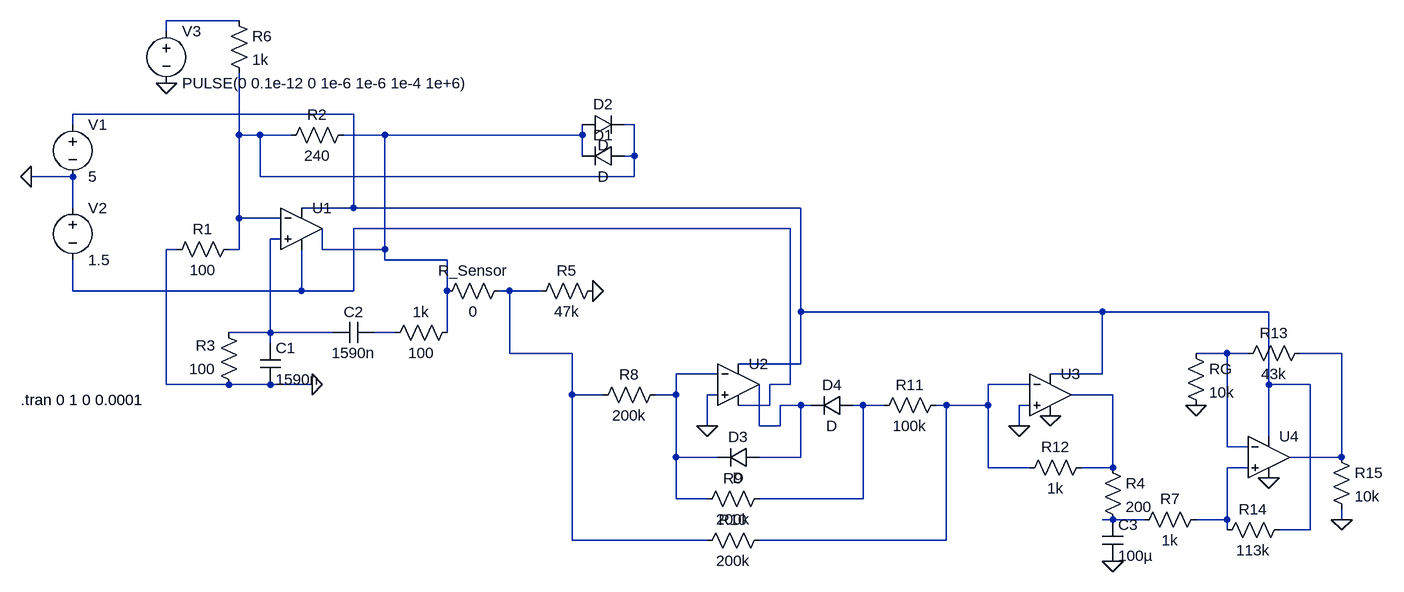
[diagram p0: schematic humidity.asc]
humidity.asc, the LTspice schematic file:
Version 4.1
SHEET 1 2160 724
WIRE 96 -176 -16 -176
WIRE -16 -160 -16 -176
WIRE 272 -32 -160 -32
WIRE -160 -16 -160 -32
WIRE 704 -16 688 -16
WIRE 96 0 96 -96
WIRE 128 0 96 0
WIRE 176 0 128 0
WIRE 320 0 256 0
WIRE 624 0 624 -16
WIRE 624 0 320 0
WIRE 624 32 624 0
WIRE 704 32 704 -16
WIRE 704 32 688 32
WIRE -160 64 -224 64
WIRE 128 64 128 0
WIRE 704 64 704 32
WIRE 704 64 128 64
WIRE -160 112 -160 64
WIRE 272 112 272 -32
WIRE 272 112 192 112
WIRE 960 112 272 112
WIRE 96 128 96 0
WIRE 160 128 96 128
WIRE 944 144 272 144
WIRE 160 160 144 160
WIRE 0 176 -16 176
WIRE 96 176 96 128
WIRE 96 176 80 176
WIRE 224 176 224 144
WIRE 320 176 320 0
WIRE 320 176 224 176
WIRE 320 192 320 176
WIRE 416 192 320 192
WIRE -160 240 -160 192
WIRE 192 240 192 176
WIRE 192 240 -160 240
WIRE 272 240 272 144
WIRE 272 240 192 240
WIRE 416 240 416 192
WIRE 512 240 496 240
WIRE 560 240 512 240
WIRE 960 272 960 112
WIRE 1424 272 960 272
WIRE 1680 272 1424 272
WIRE 144 304 144 160
WIRE 144 304 80 304
WIRE 240 304 144 304
WIRE 336 304 304 304
WIRE 416 304 416 240
WIRE 144 320 144 304
WIRE 512 336 512 240
WIRE 608 336 512 336
WIRE 1616 336 1568 336
WIRE 1648 336 1616 336
WIRE 1792 336 1728 336
WIRE 960 352 960 272
WIRE 960 352 864 352
WIRE 832 368 768 368
WIRE 1424 368 1424 272
WIRE 1424 368 1344 368
WIRE -16 384 -16 176
WIRE 80 384 -16 384
WIRE 144 384 80 384
WIRE 208 384 144 384
WIRE 944 384 944 144
WIRE 944 384 912 384
WIRE 1312 384 1248 384
WIRE 1680 384 1680 272
WIRE 1744 384 1680 384
WIRE 608 400 608 336
WIRE 656 400 608 400
WIRE 768 400 768 368
WIRE 768 400 736 400
WIRE 832 400 816 400
WIRE 1440 400 1376 400
WIRE 912 416 912 384
WIRE 912 416 864 416
WIRE 960 416 928 416
WIRE 976 416 960 416
WIRE 1056 416 1040 416
WIRE 1088 416 1056 416
WIRE 1184 416 1168 416
WIRE 1248 416 1248 384
WIRE 1248 416 1184 416
WIRE 1312 416 1296 416
WIRE 816 448 816 400
WIRE 896 448 896 384
WIRE 928 448 928 416
WIRE 928 448 896 448
WIRE 1296 448 1296 416
WIRE 1680 464 1680 384
WIRE 1616 480 1616 336
WIRE 1648 480 1616 480
WIRE 768 496 768 400
WIRE 832 496 768 496
WIRE 960 496 960 416
WIRE 960 496 896 496
WIRE 1792 496 1792 336
WIRE 1792 496 1712 496
WIRE 1248 512 1248 416
WIRE 1312 512 1248 512
WIRE 1440 512 1440 400
WIRE 1440 512 1392 512
WIRE 1648 512 1616 512
WIRE 768 560 768 496
WIRE 816 560 768 560
WIRE 1056 560 1056 416
WIRE 1056 560 896 560
WIRE 1440 592 1424 592
WIRE 1488 592 1440 592
WIRE 1616 592 1616 512
WIRE 1616 592 1568 592
WIRE 1792 592 1792 576
WIRE 1616 608 1616 592
WIRE 1744 608 1744 384
WIRE 1744 608 1696 608
WIRE 608 624 608 400
WIRE 816 624 608 624
WIRE 1184 624 1184 416
WIRE 1184 624 896 624
FLAG 208 384 0
FLAG -224 64 0
FLAG -16 -80 0
FLAG 1344 432 0
FLAG 640 240 0
FLAG 816 448 0
FLAG 1296 448 0
FLAG 1568 416 0
FLAG 1680 528 0
FLAG 1792 592 0
FLAG 1440 656 0
SYMBOL res 96 160 R90
WINDOW 0 0 56 VBottom 2
WINDOW 3 32 56 VTop 2
SYMATTR InstName R1
SYMATTR Value 100
SYMBOL res 272 -16 R90
WINDOW 0 0 56 VBottom 2
WINDOW 3 32 56 VTop 2
SYMATTR InstName R2
SYMATTR Value 240
SYMBOL res 96 400 R180
WINDOW 0 36 76 Left 2
WINDOW 3 36 40 Left 2
SYMATTR InstName R3
SYMATTR Value 100
SYMBOL cap 128 320 R0
SYMATTR InstName C1
SYMATTR Value 1590n
SYMBOL cap 304 288 R90
WINDOW 0 0 32 VBottom 2
WINDOW 3 32 32 VTop 2
SYMATTR InstName C2
SYMATTR Value 1590n
SYMBOL res 432 288 R90
WINDOW 0 0 56 VBottom 2
WINDOW 3 32 56 VTop 2
SYMATTR InstName 1k
SYMATTR Value 100
SYMBOL voltage -160 -32 R0
WINDOW 123 0 0 Left 0
WINDOW 39 0 0 Left 0
SYMATTR InstName V1
SYMATTR Value 5
SYMBOL voltage -160 96 R0
WINDOW 123 0 0 Left 0
WINDOW 39 0 0 Left 0
SYMATTR InstName V2
SYMATTR Value 1.5
SYMBOL res 80 -192 R0
SYMATTR InstName R6
SYMATTR Value 1k
SYMBOL voltage -16 -176 R0
WINDOW 123 0 0 Left 0
WINDOW 39 0 0 Left 0
SYMATTR InstName V3
SYMATTR Value PULSE(0 0.1e-12 0 1e-6 1e-6 1e-4 1e+6)
SYMBOL diode 688 16 R90
WINDOW 0 0 32 VBottom 2
WINDOW 3 32 32 VTop 2
SYMATTR InstName D1
SYMBOL diode 624 0 R270
WINDOW 0 32 32 VTop 2
WINDOW 3 0 32 VBottom 2
SYMATTR InstName D2
SYMBOL diode 896 480 R90
WINDOW 0 0 32 VBottom 2
WINDOW 3 32 32 VTop 2
SYMATTR InstName D3
SYMBOL res 752 384 R90
WINDOW 0 0 56 VBottom 2
WINDOW 3 32 56 VTop 2
SYMATTR InstName R8
SYMATTR Value 200k
SYMBOL res 912 544 R90
WINDOW 0 0 56 VBottom 2
WINDOW 3 32 56 VTop 2
SYMATTR InstName R9
SYMATTR Value 200k
SYMBOL diode 1040 400 R90
WINDOW 0 0 32 VBottom 2
WINDOW 3 32 32 VTop 2
SYMATTR InstName D4
SYMBOL res 912 608 R90
WINDOW 0 0 56 VBottom 2
WINDOW 3 32 56 VTop 2
SYMATTR InstName R10
SYMATTR Value 200k
SYMBOL res 1184 400 R90
WINDOW 0 0 56 VBottom 2
WINDOW 3 32 56 VTop 2
SYMATTR InstName R11
SYMATTR Value 100k
SYMBOL res 1408 496 R90
WINDOW 0 0 56 VBottom 2
WINDOW 3 32 56 VTop 2
SYMATTR InstName R12
SYMATTR Value 1k
SYMBOL OpAmps\\UniversalOpAmp 864 384 R0
SYMATTR InstName U2
SYMBOL OpAmps\\UniversalOpAmp 1344 400 R0
SYMATTR InstName U3
SYMBOL res 512 224 R90
WINDOW 0 0 56 VBottom 2
WINDOW 3 32 56 VTop 2
SYMATTR InstName R_Sensor
SYMATTR Value 0
SYMBOL OpAmps\\UniversalOpAmp 192 144 R0
SYMATTR InstName U1
SYMBOL res 656 224 R90
WINDOW 0 0 56 VBottom 2
WINDOW 3 32 56 VTop 2
SYMATTR InstName R5
SYMATTR Value 47k
SYMBOL OpAmps\\UniversalOpAmp 1680 496 R0
SYMATTR InstName U4
SYMBOL res 1744 320 R90
WINDOW 0 0 56 VBottom 2
WINDOW 3 32 56 VTop 2
SYMATTR InstName R13
SYMATTR Value 43k
SYMBOL res 1552 320 R0
SYMATTR InstName RG
SYMATTR Value 10k
SYMBOL res 1584 576 R90
WINDOW 0 0 56 VBottom 2
WINDOW 3 32 56 VTop 2
SYMATTR InstName R7
SYMATTR Value 1k
SYMBOL res 1712 592 R90
WINDOW 0 0 56 VBottom 2
WINDOW 3 32 56 VTop 2
SYMATTR InstName R14
SYMATTR Value 113k
SYMBOL res 1776 480 R0
SYMATTR InstName R15
SYMATTR Value 10k
SYMBOL res 1424 496 R0
SYMATTR InstName R4
SYMATTR Value 200
SYMBOL cap 1424 592 R0
SYMATTR InstName C3
SYMATTR Value 100µ
TEXT -240 408 Left 2 !.tran 0 1 0 0.0001

The netlist it stands for:
* humidity.asc
R1 N003 0 100
R2 N004 N003 240
R3 0 N006 100
C1 N006 0 1590n
C2 N008 N006 1590n
R§1k N004 N008 100
V1 N002 0 5
V2 0 N005 1.5
R6 N001 N003 1k
V3 N001 0 PULSE(0 0.1e-12 0 1e-6 1e-6 1e-4 1e+6)
D1 N003 N004 D
D2 N004 N003 D
D3 N014 N011 D
R8 N011 N007 200k
R9 N015 N011 200k
D4 N015 N014 D
R10 N012 N007 200k
R11 N012 N015 100k
R12 N013 N012 1k
X§U2 0 N011 N002 N005 N014 level1 Avol=1Meg GBW=10Meg Vos=0 En=0 Enk=0 In=0 Ink=0 Rin=500Meg  ; pins In+ In- V+ V- OUT
X§U3 0 N012 N002 0 N013 level1 Avol=1Meg GBW=10Meg Vos=0 En=0 Enk=0 In=0 Ink=0 Rin=500Meg  ; pins In+ In- V+ V- OUT
R_Sensor N007 N004 0
X§U1 N006 N003 N002 N005 N004 level1 Avol=1Meg GBW=10Meg Vos=0 En=0 Enk=0 In=0 Ink=0 Rin=500Meg  ; pins In+ In- V+ V- OUT
R5 0 N007 47k
X§U4 N016 N009 N002 0 N010 level1 Avol=1Meg GBW=10Meg Vos=0 En=0 Enk=0 In=0 Ink=0 Rin=500Meg  ; pins In+ In- V+ V- OUT
R13 N010 N009 43k
RG N009 0 10k
R7 N016 N017 1k
R14 N002 N016 113k
R15 N010 0 10k
R4 N013 N017 200
C3 N017 0 100µ
.model D D
.lib standard.dio
.tran 0 1 0 0.0001
.lib UniversalOpAmp1.lib
.backanno
.end